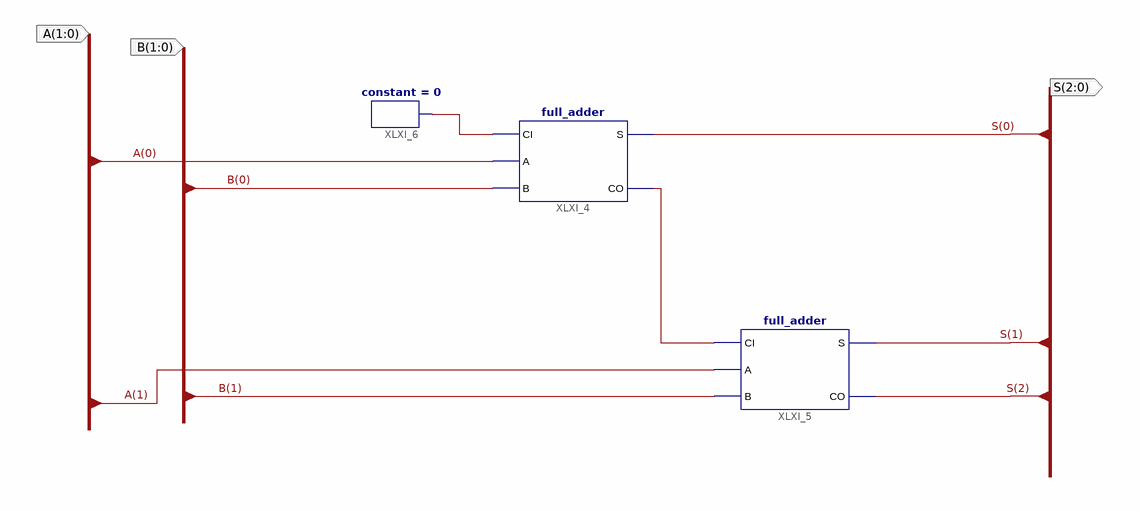
[diagram p0: schematic sheet 1]
// Xilinx ISE schematic adder.sch (spartan3e) as structural Verilog: 3 symbols, 3 ports
module adder (
  input  [1:0] B,
  input  [1:0] A,
  output [2:0] S
);

  wire XLXN_142, XLXN_143;

  full_adder XLXI_4 (.CI(XLXN_143), .A(A[0]), .B(B[0]), .S(S[0]), .CO(XLXN_142));
  full_adder XLXI_5 (.CI(XLXN_142), .A(A[1]), .B(B[1]), .S(S[1]), .CO(S[2]));
  constant #(.CValue("0")) XLXI_6 (.O(XLXN_143));
endmodule
